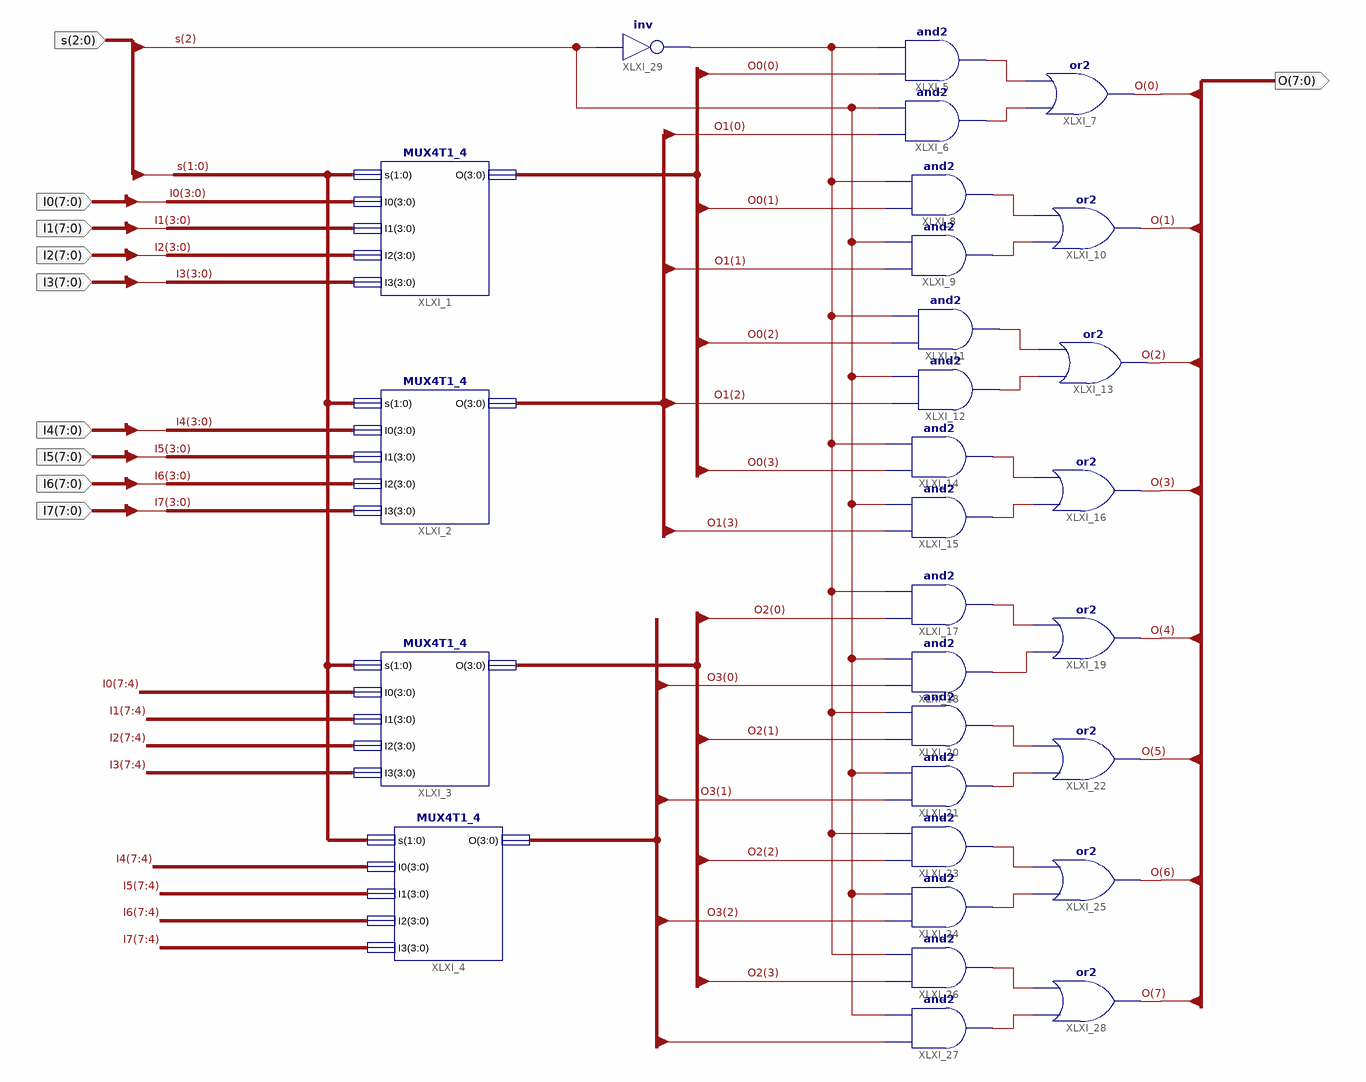
[diagram p0: schematic sheet 1]
// Xilinx ISE schematic MUX8T1_8.sch (kintex7) as structural Verilog: 29 symbols, 10 ports
module MUX8T1_8 (
  input  [2:0] s,
  input  [7:0] I1,
  input  [7:0] I2,
  input  [7:0] I3,
  input  [7:0] I0,
  input  [7:0] I4,
  input  [7:0] I5,
  input  [7:0] I6,
  input  [7:0] I7,
  output [7:0] O
);

  wire XLXN_1, XLXN_2, XLXN_3, XLXN_4, XLXN_5, XLXN_6, XLXN_7, XLXN_8, XLXN_9, XLXN_10, XLXN_11, XLXN_12,
       XLXN_13, XLXN_14, XLXN_15, XLXN_16, XLXN_62;
  wire [3:0] O0, O1, O2, O3;

  MUX4T1_4 XLXI_1 (.I0(I0[3:0]), .I1(I1[3:0]), .I2(I2[3:0]), .I3(I3[3:0]), .O(O0), .s(s[1:0]));
  MUX4T1_4 XLXI_2 (.I0(I4[3:0]), .I1(I5[3:0]), .I2(I6[3:0]), .I3(I7[3:0]), .O(O1), .s(s[1:0]));
  MUX4T1_4 XLXI_3 (.I0(I0[7:4]), .I1(I1[7:4]), .I2(I2[7:4]), .I3(I3[7:4]), .O(O2), .s(s[1:0]));
  MUX4T1_4 XLXI_4 (.I0(I4[7:4]), .I1(I5[7:4]), .I2(I6[7:4]), .I3(I7[7:4]), .O(O3), .s(s[1:0]));
  and XLXI_5 (XLXN_1, O0[0], XLXN_62);
  and XLXI_6 (XLXN_2, O1[0], s[2]);
  or XLXI_7 (O[0], XLXN_2, XLXN_1);
  and XLXI_8 (XLXN_3, O0[1], XLXN_62);
  and XLXI_9 (XLXN_4, O1[1], s[2]);
  or XLXI_10 (O[1], XLXN_4, XLXN_3);
  and XLXI_11 (XLXN_5, O0[2], XLXN_62);
  and XLXI_12 (XLXN_6, O1[2], s[2]);
  or XLXI_13 (O[2], XLXN_6, XLXN_5);
  and XLXI_14 (XLXN_7, O0[3], XLXN_62);
  and XLXI_15 (XLXN_8, O1[3], s[2]);
  or XLXI_16 (O[3], XLXN_8, XLXN_7);
  and XLXI_17 (XLXN_9, O2[0], XLXN_62);
  and XLXI_18 (XLXN_10, O3[0], s[2]);
  or XLXI_19 (O[4], XLXN_10, XLXN_9);
  and XLXI_20 (XLXN_11, O2[1], XLXN_62);
  and XLXI_21 (XLXN_12, O3[1], s[2]);
  or XLXI_22 (O[5], XLXN_12, XLXN_11);
  and XLXI_23 (XLXN_13, O2[2], XLXN_62);
  and XLXI_24 (XLXN_14, O3[2], s[2]);
  or XLXI_25 (O[6], XLXN_14, XLXN_13);
  and XLXI_26 (XLXN_15, O2[3], XLXN_62);
  and XLXI_27 (XLXN_16, O3[3], s[2]);
  or XLXI_28 (O[7], XLXN_16, XLXN_15);
  not XLXI_29 (XLXN_62, s[2]);
endmodule
